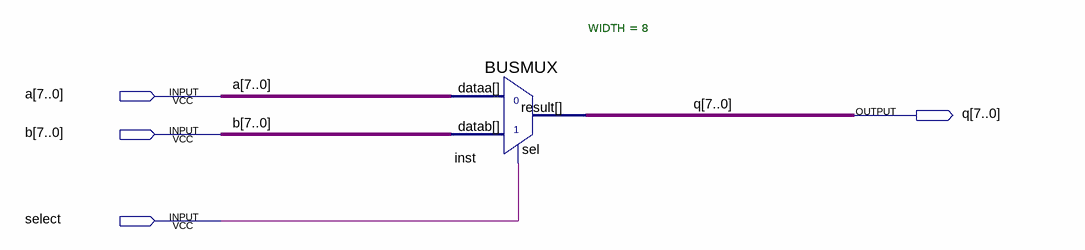
[diagram p0: schematic sheet]
// Quartus schematic mux8bit21.bdf as structural Verilog: 1 symbols, 4 pins
module mux8bit21 (
  input  [7:0] a,
  input  [7:0] b,
  input  select,
  output [7:0] q
);

  BUSMUX #(.WIDTH(8)) inst (.datab(b), .sel(select), .dataa(a), .result(q));
endmodule
